# Altium project LM35.PrjPCB
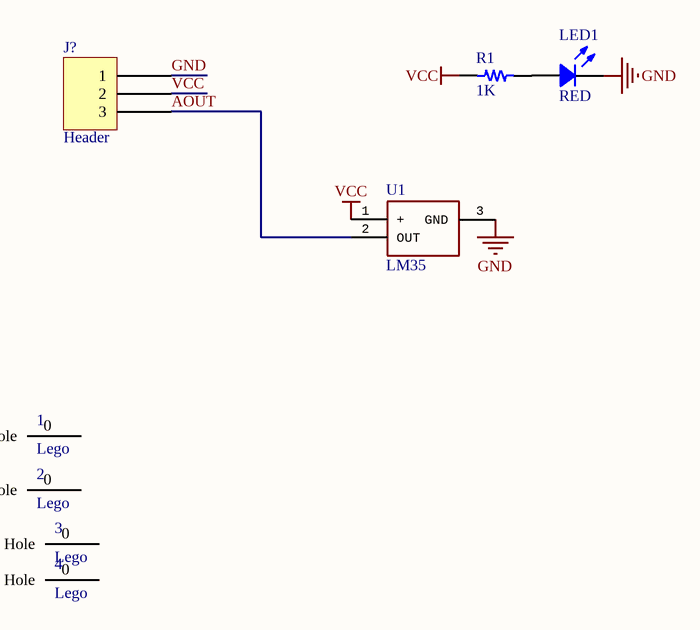
[diagram p0: LM35.SchDoc]
1 sheet, 8 parts. Net scope: global (net labels, ports and power ports of the same name join across sheets).
Board file: LM35.PcbDoc

## Sheet LM35.SchDoc
size A

### Parts
1  Lego  [Lego Hole]
2  Lego  [Lego Hole]
3  Lego  [Lego Hole]
4  Lego  [Lego Hole]
J?  Header  [JST XH B3B-XH-A - RIGHT]
LED1  RED  [LED 0805/2012 RED]
R1  1K  [RES 1206/3216]
U1  LM35  [LM35]

### Nets
GND: J?.1 LED1.2 U1.3(GND)
VCC: J?.2 R1.2 U1.1(+)
AOUT: J?.3 U1.2(OUT)
NetLED1_1: LED1.1 R1.1

Not connected (* = marked no-connect by the designer): 1 0(Lego_Hole); 2 0(Lego_Hole); 3 0(Lego_Hole); 4 0(Lego_Hole)

### Library data of the parts
J? = 3 Pin
LED1 = LED: Chip LED; Value: Green
R1 = Resistor: SMT Resistor; Value: 1K
U1 = LM35: LM35 Temperature Sensor; Designer: Seyed Mohsen Ghasemain; E-mail: picpars@gmail.com; ComponentLinkURL: www.picpars.com